# Altium schematic sheet OpenAGBoardPart1.SchDoc
size 264 x 180 mm
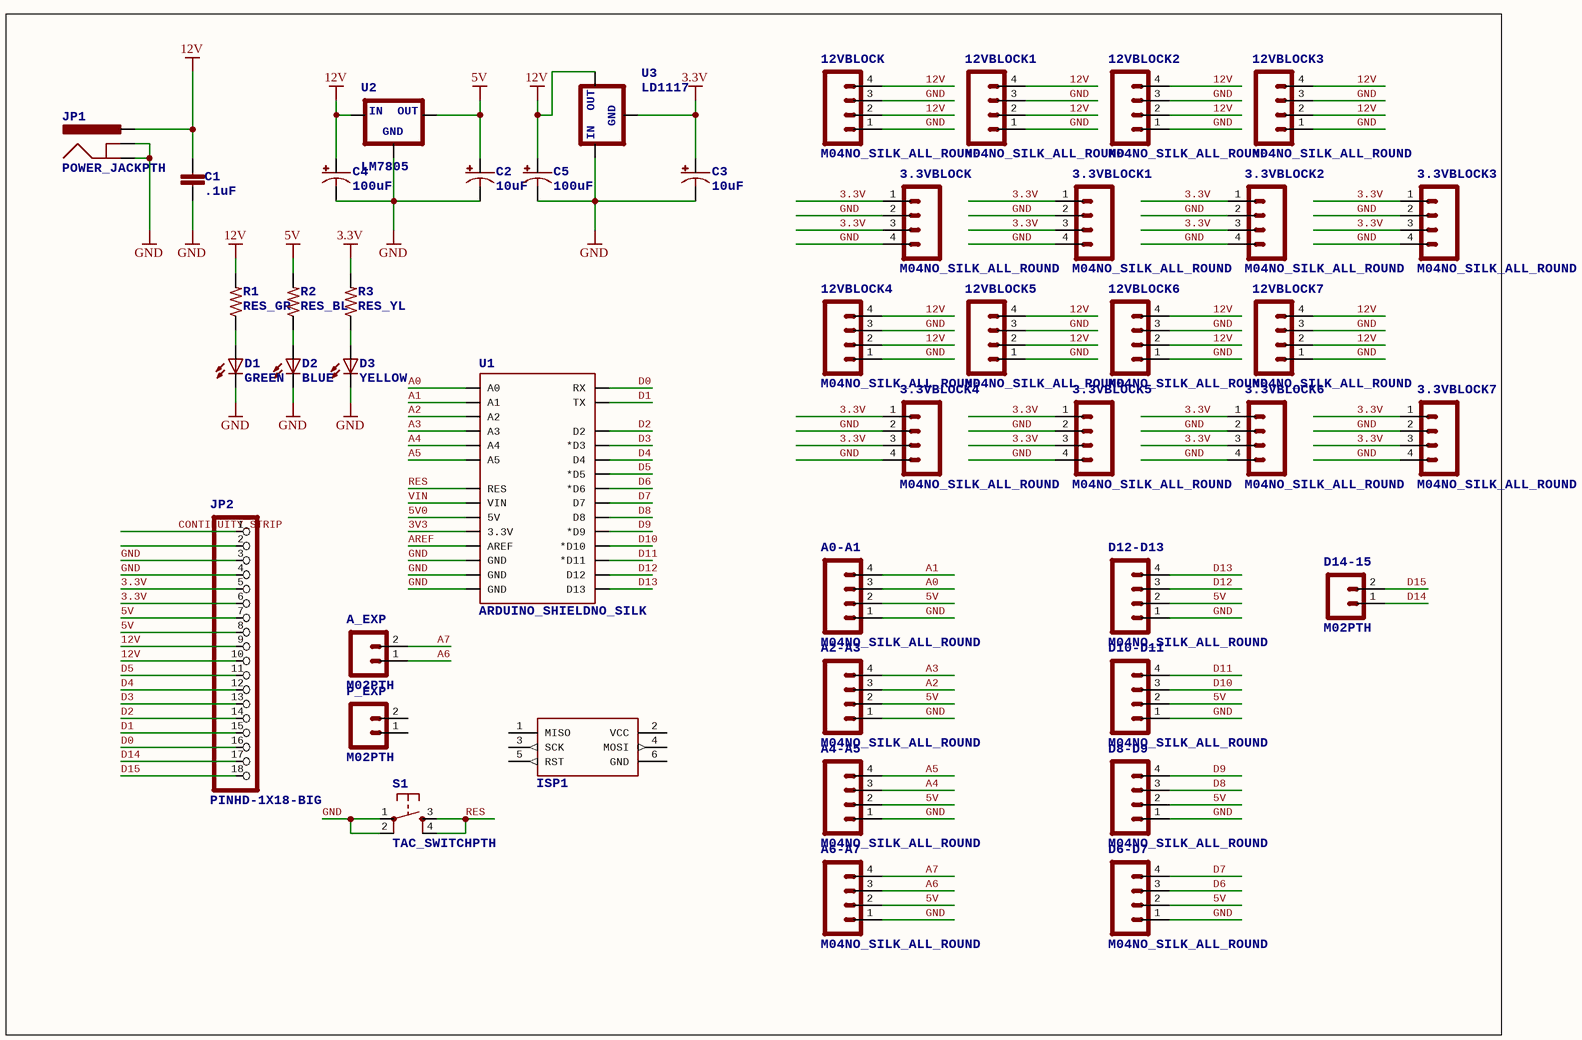
[diagram p0: OpenAGBoardPart1.SchDoc]

## Parts
3.3VBLOCK  M04NO_SILK_ALL_ROUND  [1X04_NO_SILK_ALL_ROUND]
3.3VBLOCK1  M04NO_SILK_ALL_ROUND  [1X04_NO_SILK_ALL_ROUND]
3.3VBLOCK2  M04NO_SILK_ALL_ROUND  [1X04_NO_SILK_ALL_ROUND]
3.3VBLOCK3  M04NO_SILK_ALL_ROUND  [1X04_NO_SILK_ALL_ROUND]
3.3VBLOCK4  M04NO_SILK_ALL_ROUND  [1X04_NO_SILK_ALL_ROUND]
3.3VBLOCK5  M04NO_SILK_ALL_ROUND  [1X04_NO_SILK_ALL_ROUND]
3.3VBLOCK6  M04NO_SILK_ALL_ROUND  [1X04_NO_SILK_ALL_ROUND]
3.3VBLOCK7  M04NO_SILK_ALL_ROUND  [1X04_NO_SILK_ALL_ROUND]
12VBLOCK  M04NO_SILK_ALL_ROUND  [1X04_NO_SILK_ALL_ROUND]
12VBLOCK1  M04NO_SILK_ALL_ROUND  [1X04_NO_SILK_ALL_ROUND]
12VBLOCK2  M04NO_SILK_ALL_ROUND  [1X04_NO_SILK_ALL_ROUND]
12VBLOCK3  M04NO_SILK_ALL_ROUND  [1X04_NO_SILK_ALL_ROUND]
12VBLOCK4  M04NO_SILK_ALL_ROUND  [1X04_NO_SILK_ALL_ROUND]
12VBLOCK5  M04NO_SILK_ALL_ROUND  [1X04_NO_SILK_ALL_ROUND]
12VBLOCK6  M04NO_SILK_ALL_ROUND  [1X04_NO_SILK_ALL_ROUND]
12VBLOCK7  M04NO_SILK_ALL_ROUND  [1X04_NO_SILK_ALL_ROUND]
A0-A1  M04NO_SILK_ALL_ROUND  [1X04_NO_SILK_ALL_ROUND]
A2-A3  M04NO_SILK_ALL_ROUND  [1X04_NO_SILK_ALL_ROUND]
A4-A5  M04NO_SILK_ALL_ROUND  [1X04_NO_SILK_ALL_ROUND]
A6-A7  M04NO_SILK_ALL_ROUND  [1X04_NO_SILK_ALL_ROUND]
A_EXP  M02PTH  [1X02]
C1  .1uF  [CAP-PTH-SMALL]
C2  10uF  [CPOL-RADIAL-10UF-25V]
C3  10uF  [CPOL-RADIAL-10UF-25V]
C4  100uF  [CPOL-RADIAL-100UF-25V]
C5  100uF  [CPOL-RADIAL-100UF-25V]
D1  GREEN  [LED5MM]
D2  BLUE  [LED5MM]
D3  YELLOW  [LED5MM]
D6-D7  M04NO_SILK_ALL_ROUND  [1X04_NO_SILK_ALL_ROUND]
D8-D9  M04NO_SILK_ALL_ROUND  [1X04_NO_SILK_ALL_ROUND]
D10-D11  M04NO_SILK_ALL_ROUND  [1X04_NO_SILK_ALL_ROUND]
D12-D13  M04NO_SILK_ALL_ROUND  [1X04_NO_SILK_ALL_ROUND]
D14-15  M02PTH  [1X02]
ISP1  AVRISP-6  [AVRISP]  (value not drawn)
JP1  POWER_JACKPTH  [POWER_JACK_PTH]
JP2  PINHD-1X18-BIG  [1X18-BIG]
P_EXP  M02PTH  [1X02]
R1  RES_GR  [AXIAL-0.4]
R2  RES_BL  [AXIAL-0.4]
R3  RES_YL  [AXIAL-0.4]
S1  TAC_SWITCHPTH  [TACTILE-PTH]
U1  ARDUINO_SHIELDNO_SILK  [DUEMILANOVE_VIAS]
U2  LM7805  [TO220-IGO]
U3  LD1117  [TO220-IGO]

## Nets
3.3V: 3.3VBLOCK.1 3.3VBLOCK.3 3.3VBLOCK1.1 3.3VBLOCK1.3 3.3VBLOCK2.1 3.3VBLOCK2.3 3.3VBLOCK3.1 3.3VBLOCK3.3 3.3VBLOCK4.1 3.3VBLOCK4.3 3.3VBLOCK5.1 3.3VBLOCK5.3 3.3VBLOCK6.1 3.3VBLOCK6.3 3.3VBLOCK7.1 3.3VBLOCK7.3 C3.1(+) JP2.5 JP2.6 R3.P$2 U3.GND
5V: A0-A1.2 A2-A3.2 A4-A5.2 A6-A7.2 C2.1(+) D6-D7.2 D8-D9.2 D10-D11.2 D12-D13.2 JP2.7 JP2.8 R2.P$2 U2.OUT
12V: 12VBLOCK.2 12VBLOCK.4 12VBLOCK1.2 12VBLOCK1.4 12VBLOCK2.2 12VBLOCK2.4 12VBLOCK3.2 12VBLOCK3.4 12VBLOCK4.2 12VBLOCK4.4 12VBLOCK5.2 12VBLOCK5.4 12VBLOCK6.2 12VBLOCK6.4 12VBLOCK7.2 12VBLOCK7.4 C1.1 C4.1(+) C5.1(+) JP1.PWR JP2.9 JP2.10 R1.P$2 U2.IN U3.OUT
GND: 3.3VBLOCK.2 3.3VBLOCK.4 3.3VBLOCK1.2 3.3VBLOCK1.4 3.3VBLOCK2.2 3.3VBLOCK2.4 3.3VBLOCK3.2 3.3VBLOCK3.4 3.3VBLOCK4.2 3.3VBLOCK4.4 3.3VBLOCK5.2 3.3VBLOCK5.4 3.3VBLOCK6.2 3.3VBLOCK6.4 3.3VBLOCK7.2 3.3VBLOCK7.4 12VBLOCK.1 12VBLOCK.3 12VBLOCK1.1 12VBLOCK1.3 12VBLOCK2.1 12VBLOCK2.3 12VBLOCK3.1 12VBLOCK3.3 12VBLOCK4.1 12VBLOCK4.3 12VBLOCK5.1 12VBLOCK5.3 12VBLOCK6.1 12VBLOCK6.3 12VBLOCK7.1 12VBLOCK7.3 A0-A1.1 A2-A3.1 A4-A5.1 A6-A7.1 C1.2 C2.2(-) C3.2(-) C4.2(-) C5.2(-) D1.K(C) D2.K(C) D3.K(C) D6-D7.1 D8-D9.1 D10-D11.1 D12-D13.1 JP1.GND JP1.GNDBREAK JP2.3 JP2.4 S1.1 S1.2 U1.GND@0(GND) U1.GND@1(GND) U1.GND@2(GND) U2.GND U3.IN
3V3: U1.3.3V
5V0: U1.5V
A0: A0-A1.3 U1.A0
A1: A0-A1.4 U1.A1
A2: A2-A3.3 U1.A2
A3: A2-A3.4 U1.A3
A4: A4-A5.3 U1.A4
A5: A4-A5.4 U1.A5
A6: A6-A7.3 A_EXP.1
A7: A6-A7.4 A_EXP.2
AREF: U1.AREF
CONTINUITY_STRIP: JP2.1
D0: JP2.16 U1.RX
D1: JP2.15 U1.TX
D2: JP2.14 U1.D2
D3: JP2.13 U1.D3(*D3)
D4: JP2.12 U1.D4
D5: JP2.11 U1.D5(*D5)
D6: D6-D7.3 U1.D6(*D6)
D7: D6-D7.4 U1.D7
D8: D8-D9.3 U1.D8
D9: D8-D9.4 U1.D9(*D9)
D10: D10-D11.3 U1.D10(*D10)
D11: D10-D11.4 U1.D11(*D11)
D12: D12-D13.3 U1.D12
D13: D12-D13.4 U1.D13
D14: D14-15.1 JP2.17
D15: D14-15.2 JP2.18
RES: S1.3 S1.4 U1.RES
VIN: U1.VIN
NetD1_A: D1.A R1.P$1
NetD2_A: D2.A R2.P$1
NetD3_A: D3.A R3.P$1

Not connected (* = marked no-connect by the designer): ISP1 1(MISO) 2(VCC) 3(SCK) 4(MOSI) 5(RST) 6(GND); JP2 2; P_EXP 1 2

## Library data of the parts
3.3VBLOCK 3.3VBLOCK1-3.3VBLOCK7 12VBLOCK 12VBLOCK1-12VBLOCK7 A0-A1 A2-A3 A4-A5 A6-A7 D6-D7 D8-D9 D10-D11 D12-D13 = M04NO_SILK_ALL_ROUND: Header 4Standard 4-pin 0.1" header. Use with straight break away headers (SKU : PRT-00116), right angle break away headers (PRT-00553), swiss pins (PRT-00743), machine pins (PRT-00117), and female headers (PRT-00115). Molex polarized connector foot print use with SKU : PRT-08231 with associated crimp pins and housings. 1MM SMD Version SKU: PRT-10208
A_EXP D14-15 P_EXP = M02PTH: Standard 2-pin 0.1" header. Use with  - straight break away headers ( PRT-00116) - right angle break away headers (PRT-00553) - swiss pins (PRT-00743) - machine pins (PRT-00117) - female headers (PRT-00115)   Molex polarized connector foot print use with: PRT-08233 with associated crimp pins and housings.  2.54_SCREWTERM for use with  PRT-10571.  3.5mm Screw Terminal footprints for  PRT-08084  5mm Screw Terminal footprints for use with PRT-08432
C1 = CAPPTH: CapacitorStandard 0603 ceramic capacitor, and 0.1" leaded capacitor.
C2 C3 = CAP_POLPTH2: Capacitor PolarizedThese are standard SMD and PTH capacitors. Normally 10uF, 47uF, and 100uF in electrolytic and tantalum varieties. Always verify the external diameter of the through hole cap, it varies with capacity, voltage, and manufacturer. The EIA devices should be standard.
C4 C5 = CAP_POLPTH1: Capacitor PolarizedThese are standard SMD and PTH capacitors. Normally 10uF, 47uF, and 100uF in electrolytic and tantalum varieties. Always verify the external diameter of the through hole cap, it varies with capacity, voltage, and manufacturer. The EIA devices should be standard.
D1-D3 = LED5MM: LED   OSRAM: - CHIPLED LG R971, LG N971, LY N971, LG Q971, LY Q971, LO R971, LY R971 LH N974, LH R974 LS Q976, LO Q976, LY Q976 LO Q996 - Hyper CHIPLED LW Q18S LB Q993, LB Q99A, LB R99A - SideLED LS A670, LO A670, LY A670, LG A670, LP A670 LB A673, LV A673, LT A673, LW A673 LH A674 LY A675 LS A676, LA A676, LO A676, LY A676, LW A676 LS A679, LY A679, LG A679 -  Hyper Micro SIDELED® LS Y876, LA Y876, LO Y876, LY Y876 LT Y87S - SmartLED LW L88C, LW L88S LB L89C, LB L89S, LG L890 LS L89K, LO L89K, LY L89K LS L896, LA L896, LO L896, LY L896 - TOPLED LS T670, LO T670, LY T670, LG T670, LP T670 LSG T670, LSP T670, LSY T670, LOP T670, LYG T670 LG T671, LOG T671, LSG T671 LB T673, LV T673, LT T673, LW T673 LH T674 LS T676, LA T676, LO T676, LY T676, LB T676, LH T676, LSB T676, LW T676 LB T67C, LV T67C, LT T67C, LS T67K, LO T67K, LY T67K, LW E67C LS E67B, LA E67B, LO E67B, LY E67B, LB E67C, LV E67C, LT E67C LW T67C LS T679, LY T679, LG T679 LS T770, LO T770, LY T770, LG T770, LP T770 LB T773, LV T773, LT T773, LW T773 LH T774 LS E675, LA E675, LY E675, LS T675 LS T776, LA T776, LO T776, LY T776, LB T776 LHGB T686 LT T68C, LB T68C - Hyper Mini TOPLED® LB M676 - Mini TOPLED Santana® LG M470 LS M47K, LO M47K, LY M47K    Source: http://www.osram.convergy.de/
ISP1 = AVRISP-6: AVR ISP HEADER Standard 6 pin header for AVR programming
JP1 = POWER_JACKPTH: Power JackThis is the standard 5.5mm barrel jack for power. The PTH is the most common, proven, reliable, footprint. The Slot footprint only works if the mill layer is transmitted to the PCB fab house so be warned. Mating wall wart : TOL-00298 (and others); PROD_ID: CONN-08197
JP2 = PINHD-1X18-BIG: PIN HEADER
R1-R3 = RESISTORPTH-1/4W: ResistorBasic schematic elements and footprints for 0603, 1206, and PTH resistors.
S1 = TAC_SWITCHPTH: Momentary Switch Button commonly used for reset or general input. Spark Fun Electronics SKU : COM-00097 SMT- SWCH-08247
U1 = ARDUINO_SHIELDNO_SILK: Arduino shield footprint
U2 U3 = V_REG_78XXSINK: Voltage RegulatorStandard 78xx regulator. IGO (Input Ground Output). Spark Fun Electronics SKU : COM-00107; GND: GND; IN: IN; OUT: OUT